# Altium schematic sheet Mobile_adapter_5V_1A_LQ.SchDoc
size A; SheetNumber: 1; SheetTotal: 1
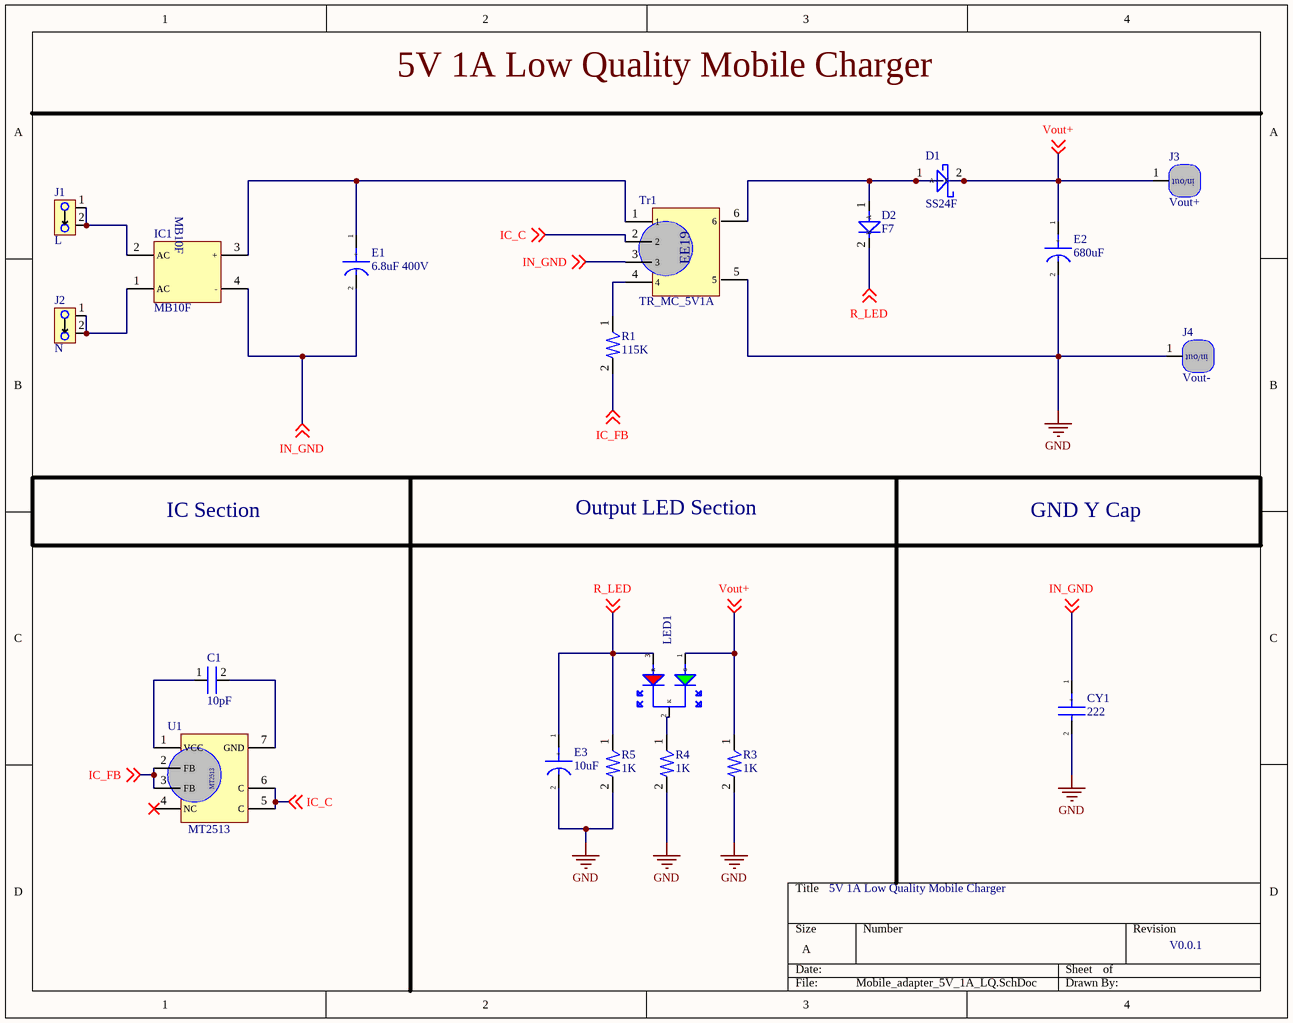
[diagram p0: Mobile_adapter_5V_1A_LQ.SchDoc]

## Parts
C1  10pF  [C_0603]
CY1  222  [C_TH_104/102]
D1  SS24F  [SMAF]
D2  F7  [SOD123F-F7]
E1  6.8uF 400V  [CAP_D8XL13]
E2  680uF  [CAP_D6.5XL12]
E3  10uF  [CAP_D5XL11]
IC1  MB10F  [MB10F]
J1  L  [MMT Metal shrapnel connector]
J2  N  [MMT Metal shrapnel connector]
J3  Vout+  [Wire solder connector _SMD - duplicate]
J4  Vout-  [Wire solder connector _SMD - duplicate]
LED1  LED 3mm RG Com cathod  [LED_RG_3mm]  (value not drawn)
R1  115K  [R_0603]
R3  1K  [R_0603]
R4  1K  [R_0603]
R5  1K  [R_0603]
Tr1  TR_MC_5V1A  [T_EE19_5V1A]
U1  MT2513  [SOP8-7]

## Nets
GND: CY1.2(-) E2.2(-) E3.2(-) J4.1 R3.2 R4.2 R5.2 Tr1.5
IC_C: Tr1.2 U1.5(C) U1.6(C) ; off-sheet IC_C
IC_FB: R1.2 U1.2(FB) U1.3(FB) ; off-sheet IC_FB
IN_GND: CY1.1(+) E1.2(-) IC1.4(-) Tr1.3 ; off-sheet IN_GND
R_LED: D2.2(K) E3.1(+) LED1.3(R) R5.1 ; off-sheet R_LED
Vout+: D1.2(K) E2.1(+) J3.1 LED1.1(G) R3.1 ; off-sheet Vout+
NetC1_1: C1.1 U1.1(VCC)
NetC1_2: C1.2 U1.7(GND)
NetD1_1: D1.1(A) D2.1(A) Tr1.6
NetE1_1: E1.1(+) IC1.3(+) Tr1.1
NetIC1_1: IC1.1(AC) J2.1 J2.2
NetIC1_2: IC1.2(AC) J1.1 J1.2
NetLED1_2: LED1.2(K) R4.1
NetR1_1: R1.1 Tr1.4

Not connected (* = marked no-connect by the designer): U1 4(NC)*

## Notes on the sheet
- 5V 1A Low Quality Mobile Charger
- IC Section
- Output LED Section
- GND Y Cap
- V0.0.1
- (in symbol T_EE19_5V1A) EE19
- (in symbol Wire solder connector _SMD) in/out

## Library data of the parts
C1 = C_0603: 25V 10pF C0G ±5% 0603 Multilayer Ceramic Capacitors MLCC - SMD/SMT ROHS; PN: CGA0603C0G100J250JT; Link: https://lcsc.com/product-detail/Multilayer-Ceramic-Capacitors-MLCC-SMD-SMT_HRE-CGA0603C0G100J250JT_C41361115.html
CY1 = C_TH_104/102: Keltron 222 1kv Capacitor; PN: *; Link: https://www.indiamart.com/proddetail/222-1kv-capacitor-27431526388.html?srsltid=AfmBOooTugq0epycLVitZ6jGxnjvQJHEQvSUTzlPssH3imFvuBxUUXmC
D1 = D_SS24F_SK_SMAF: 40V 550mV@2A 2A SMAF Schottky Diodes ROHS; PN: SS24F; Link: https://lcsc.com/product-detail/Schottky-Diodes_Guangdong-Hottech-SS24F_C190803.html?s_z=n_SS24F
D2 = D_F7_SOD123: 1.3V@1A 500ns Independent Type 1A 1kV SOD-123F Fast Recovery / High Efficiency Diodes ROHS; PN: F7; Link: https://lcsc.com/product-detail/Fast-Recovery-High-Efficiency-Diodes_HXY-MOSFET-F7_C5199090.html?s_z=n_F7
E1 = C_D8XL13: 6.8uF 400V ±20% Plugin,D8xL12mm Aluminum Electrolytic Capacitors - Leaded ROHS; PN: EGS2GM6R8F12OT; Link: https://lcsc.com/product-detail/Aluminum-Electrolytic-Capacitors-Leaded_AISHI-Aihua-Group-EGS2GM6R8F12OT_C112471.html?s_z=n_Capacitors
E2 = C_D6.5XL12: 680uF 6.3V ±20% Plugin,D6.3xL12mm Aluminum Electrolytic Capacitors - Leaded ROHS; PN: ERR0JM681E12OT; Link: 680uF 6.3V ±20% Plugin,D6.3xL12mm Aluminum Electrolytic Capacitors - Leaded ROHS
E3 = C_D5XL11: 10uF 50V ±20% Plugin,D5xL7mm Aluminum Electrolytic Capacitors - Leaded ROHS; PN: 50V10uF CD110; Link: https://lcsc.com/product-detail/Aluminum-Electrolytic-Capacitors-Leaded_HRK-50V10uF-CD110_C2960200.html
IC1 = MB10F: 30A 1.1V@800mA 800mA 1kV MBF Bridge Rectifiers ROHS; Link: https://lcsc.com/product-detail/Bridge-Rectifiers_Guangdong-Hottech-MB10F_C193012.html?s_z=n_MB10F; PN: MB10F
J1 J2 = Metal Shrapnel mmt connector: Metal Shrapnel mmt connector mobile charger; PN: *; Link: https://mmt2018.en.made-in-china.com/product/rjtmlFMyLiks/China-Mmt-AC-Mobile-Phone-Charger-Metal-Shrapnel-Contact.html
J3 J4 = Wire solder connector _SMD
LED1 = LED 3mm RG Com cathod: Red Green Common Cathode  P=2.54mm; PN: XL-A324SURSYGW; Link: https://www.lcsc.com/datasheet/lcsc_datasheet_2401120947_XINGLIGHT-XL-A324SURSYGW_C2895562.pdf
R1 = R_0603: 100mW Thin Film Resistor ±50ppm/℃ ±0.1% 115kΩ 0603 Chip Resistor - Surface Mount ROHS; PN: RT0603BRE07115KL; Link: https://lcsc.com/product-detail/Chip-Resistor-Surface-Mount_YAGEO-RT0603BRE07115KL_C861635.html
R3-R5 = R_0603: 100mW Thick Film Resistors 75V ±100ppm/℃ ±1% 1kΩ 0603 Chip Resistor - Surface Mount ROHS; PN: 0603WAF1001T5E; Link: https://lcsc.com/product-detail/Chip-Resistor-Surface-Mount_UNI-ROYAL-Uniroyal-Elec-0603WAF1001T5E_C21190.html
Tr1 = T_EE19_5V1A: Link: *; PN: *
U1 = MT2513: MT2513 SOP8 Integrated Circuits; Link: https://www.worldwayelec.com/pro/newhaven-display-international/mt2513/4924573/mt2513.pdf?utm_source=chatgpt.com; PN: MT2513